# EAGLE design picstick_27j53_v1 (EAGLE 7.2.0)
pickstick - open source hardware
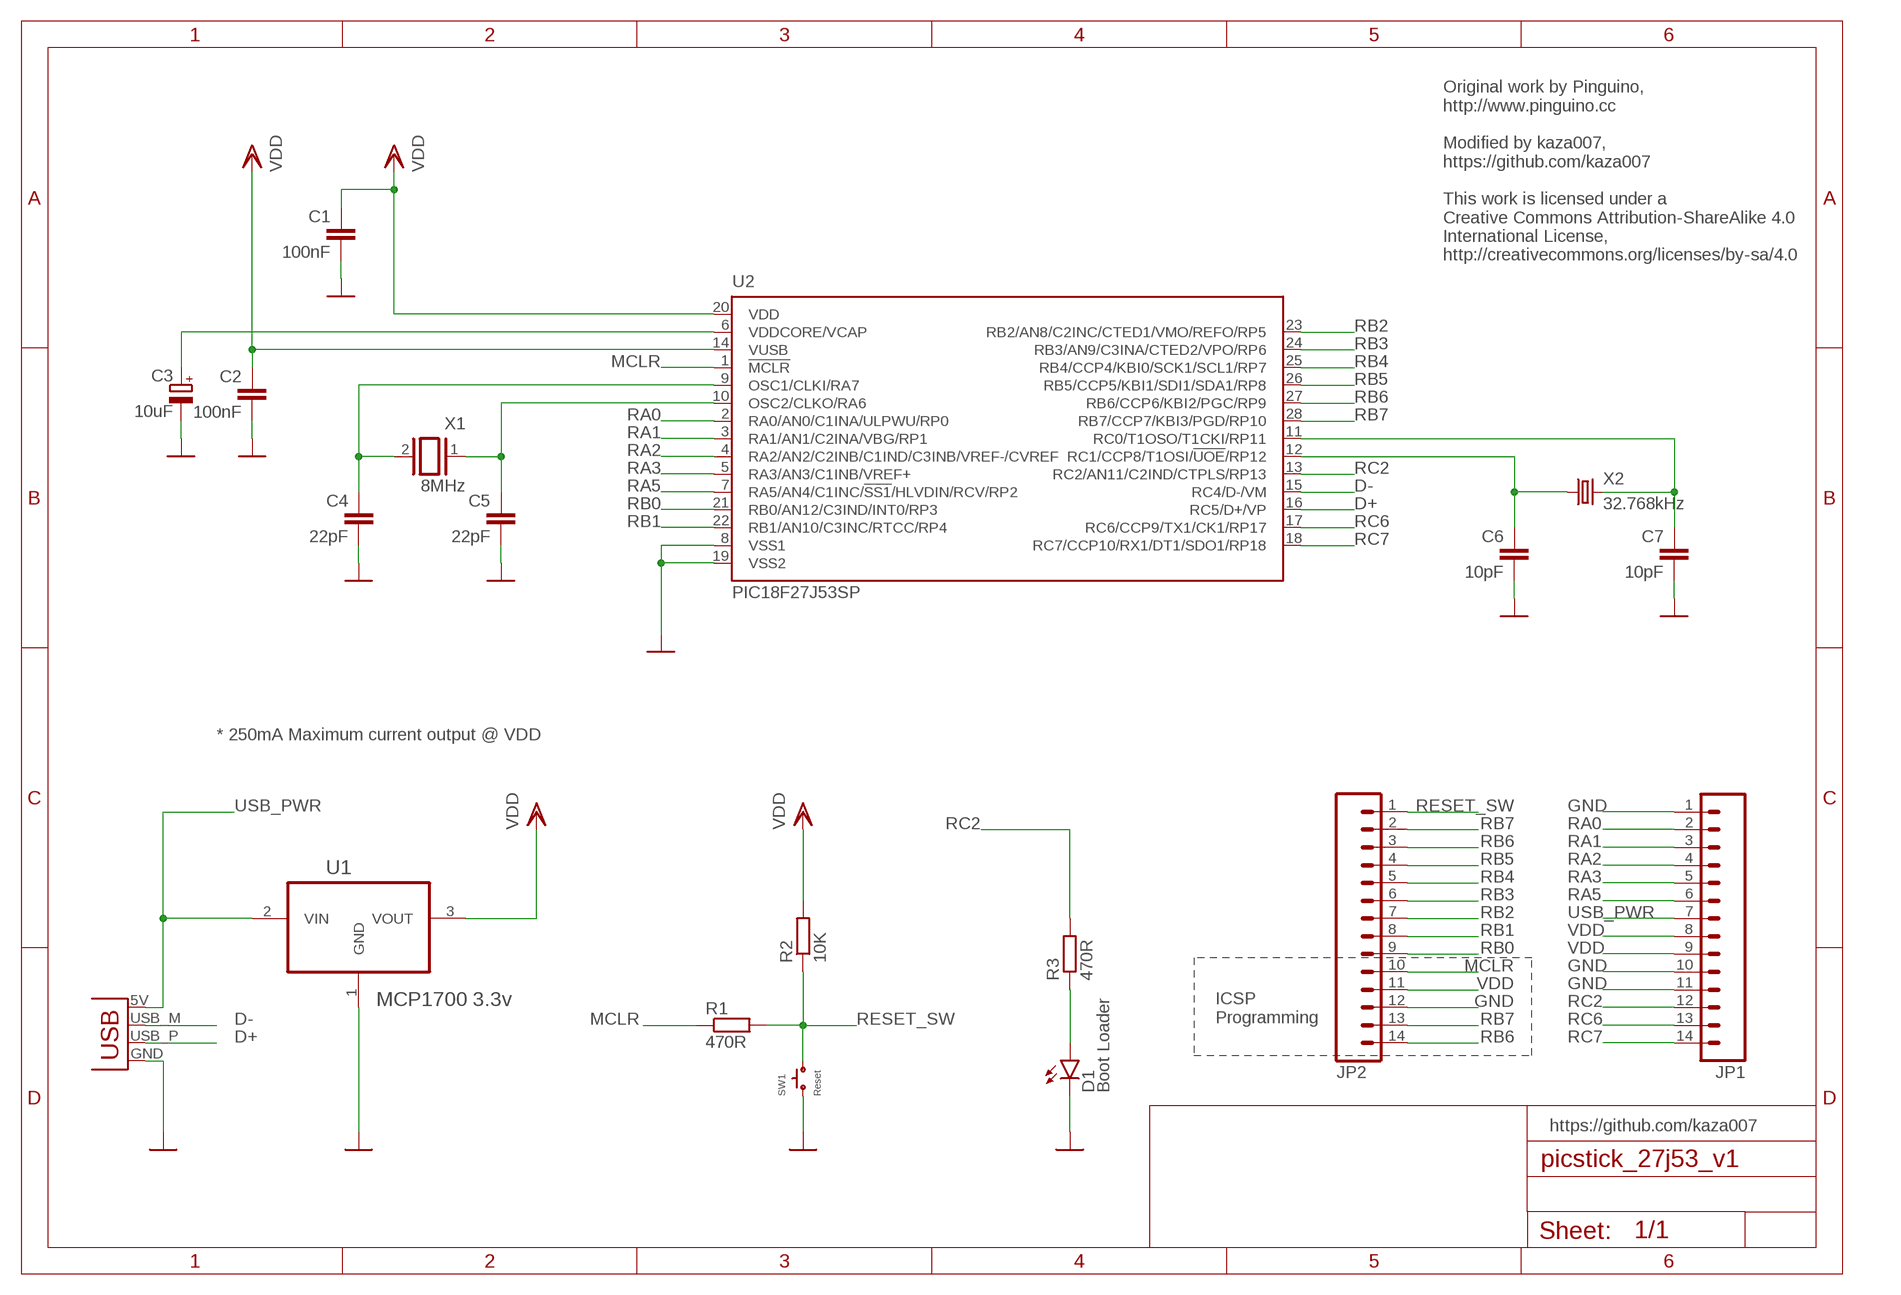
[diagram p0: schematic, sheet 1]

## Parts
C1  100nF  C-EU050-024X044  [C050-024X044]
C2  100nF  C-EU050-024X044  [C050-024X044]
C3  10uF  CPOL-EUE2.5-5  [E2,5-5]
C4  22pF  C-EU025-024X044  [C025-024X044]
C5  22pF  C-EU025-024X044  [C025-024X044]
C6  10pF  C-EU025-024X044  [C025-024X044]
C7  10pF  C-EU025-024X044  [C025-024X044]
D1  Boot Loader  LED3MM  [LED3MM]
JP1  FREETRONICS-JON_M14  [FREETRONICS-JON_1X14]
JP2  FREETRONICS-JON_M14  [FREETRONICS-JON_1X14]
R1  470R  R-EU_0204/7  [0204/7]
R2  10K  R-EU_0204/7  [0204/7]
R3  470R  R-EU_0204/7  [0204/7]
SW1  Reset  SKHLAAA010  [SKHLAAA010]
U1  MCP1700 3.3v  MCP1700-3302E/TO  [TO127P254X495-3]
U2  PIC18F27J53SP  [DIL28-3]
USB  FREETRONICS-MASTER-V1_USBPCB  [FREETRONICS-MASTER-V1_USB-A-PCB]
X1  8MHz  XTAL/S  [QS]
X2  32.768kHz  CRYSTALTC26H  [TC26H]

## Nets
D+: U2.16(RC5/D+/VP) USB.USB_P(D+)
D-: U2.15(RC4/D-/VM) USB.USB_M(D-)
GND: C1.2 C2.2 C3.- C4.2 C5.2 C6.2 C7.2 D1.K(C) JP1.1 JP1.10 JP1.11 JP2.12 SW1.1 U1.1(GND) U2.8(VSS1) U2.19(VSS2) USB.GND
MCLR: JP2.10 R1.1 U2.1(!MCLR)
N$1: C4.1 U2.9(OSC1/CLKI/RA7) X1.2
N$2: C5.1 U2.10(OSC2/CLKO/RA6) X1.1
N$3: C3.+ U2.6(VDDCORE/VCAP)
N$4: C7.1 U2.11(RC0/T1OSO/T1CKI/RP11) X2.2
N$5: C6.1 U2.12(RC1/CCP8/T1OSI/!UOE!/RP12) X2.1
N$6: D1.A R3.1
RA0: JP1.2 U2.2(RA0/AN0/C1INA/ULPWU/RP0)
RA1: JP1.3 U2.3(RA1/AN1/C2INA/VBG/RP1)
RA2: JP1.4 U2.4(RA2/AN2/C2INB/C1IND/C3INB/VREF-/CVREF)
RA3: JP1.5 U2.5(RA3/AN3/C1INB/VREF+)
RA5: JP1.6 U2.7(RA5/AN4/C1INC/!SS1!/HLVDIN/RCV/RP2)
RB0: JP2.9 U2.21(RB0/AN12/C3IND/INT0/RP3)
RB1: JP2.8 U2.22(RB1/AN10/C3INC/RTCC/RP4)
RB2: JP2.7 U2.23(RB2/AN8/C2INC/CTED1/VMO/REFO/RP5)
RB3: JP2.6 U2.24(RB3/AN9/C3INA/CTED2/VPO/RP6)
RB4: JP2.5 U2.25(RB4/CCP4/KBI0/SCK1/SCL1/RP7)
RB5: JP2.4 U2.26(RB5/CCP5/KBI1/SDI1/SDA1/RP8)
RB6: JP2.3 JP2.14 U2.27(RB6/CCP6/KBI2/PGC/RP9)
RB7: JP2.2 JP2.13 U2.28(RB7/CCP7/KBI3/PGD/RP10)
RC2: JP1.12 R3.2 U2.13(RC2/AN11/C2IND/CTPLS/RP13)
RC6: JP1.13 U2.17(RC6/CCP9/TX1/CK1/RP17)
RC7: JP1.14 U2.18(RC7/CCP10/RX1/DT1/SDO1/RP18)
RESET_SW: JP2.1 R1.2 R2.1 SW1.2
USB_PWR: JP1.7 U1.2(VIN) USB.5V(VBUS)
VDD: C1.1 C2.1 JP1.8 JP1.9 JP2.11 R2.2 U1.3(VOUT) U2.14(VUSB) U2.20(VDD)

## Notes on the sheet
- Original work by Pinguino,
  http://www.pinguino.cc
  
  Modified by kaza007,
  https://github.com/kaza007
  
  This work is licensed under a 
  Creative Commons Attribution-ShareAlike 4.0
  International License,
  http://creativecommons.org/licenses/by-sa/4.0
- * 250mA Maximum current output @ VDD
- ICSP
  Programming
- https://github.com/kaza007

## Library data of the parts
C1 C2 C4-C7 = rcl:C-EU: CAPACITOR, European symbol
C3 = rcl:CPOL-EU: POLARIZED CAPACITOR, European symbol
D1 = gm-diodes:LED
JP1 JP2 = LeoStick:FREETRONICS-JON_M14: Header 14 Standard 14-pin 0.1" header. Use with straight break away headers (SKU : PRT-00116), right angle break away headers (PRT-00553), swiss pins (PRT-00743), machine pins (PRT-00117), and female headers (PRT-00115).
R1-R3 = rcl:R-EU_: RESISTOR, European symbol
SW1 = alps:SKHLAAA010
U1 = mcp1700:MCP1700-3302E/TO: IC, Low Quiescent Current LDO,3.3V,TO-92; MPN: MCP1700-3302E/TO; OC_FARNELL: 1296588; OC_NEWARK: 88H9804; PACKAGE: TO-92; SUPPLIER: Microchip
U2 = microchip:PIC18F2*J53: PIC18F47J53 Family High-Performance USB Microcontrollers with nanoWatt XLP Technology Source: Data sheet <http://ww1.microchip.com/downloads/en/DeviceDoc/39964B.pdf>; MPN: PIC18F27J53-I/SP; OC_FARNELL: unknown; OC_NEWARK: 63R7839
USB = LeoStick:FREETRONICS-MASTER-V1_USB: USB Connectors USB-B-PTH is fully proven SKU : PRT-00139 USB-miniB is fully proven SKU : PRT-00587 USB-A-PCB is untested. USB-A-H is throughly reviewed, but untested. Spark Fun Electronics SKU : PRT-00437 USB-B-SMT is throughly reviewed, but untested. Needs silkscreen touching up. USB-A-S has not been used/tested USB-MB-H has not been used/tested
X1 = special:XTAL/S: CRYSTAL
X2 = crystal:CRYSTAL: CRYSTAL; OC_FARNELL: unknown; OC_NEWARK: unknown

## Board
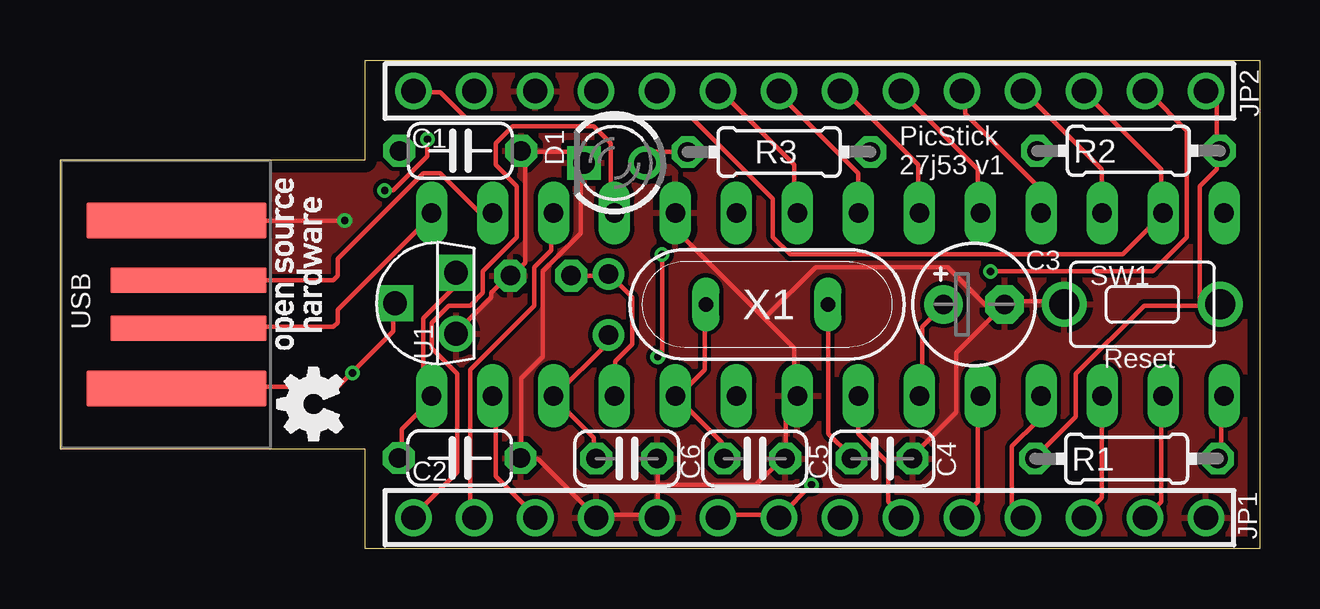
[diagram p1: board, top side]
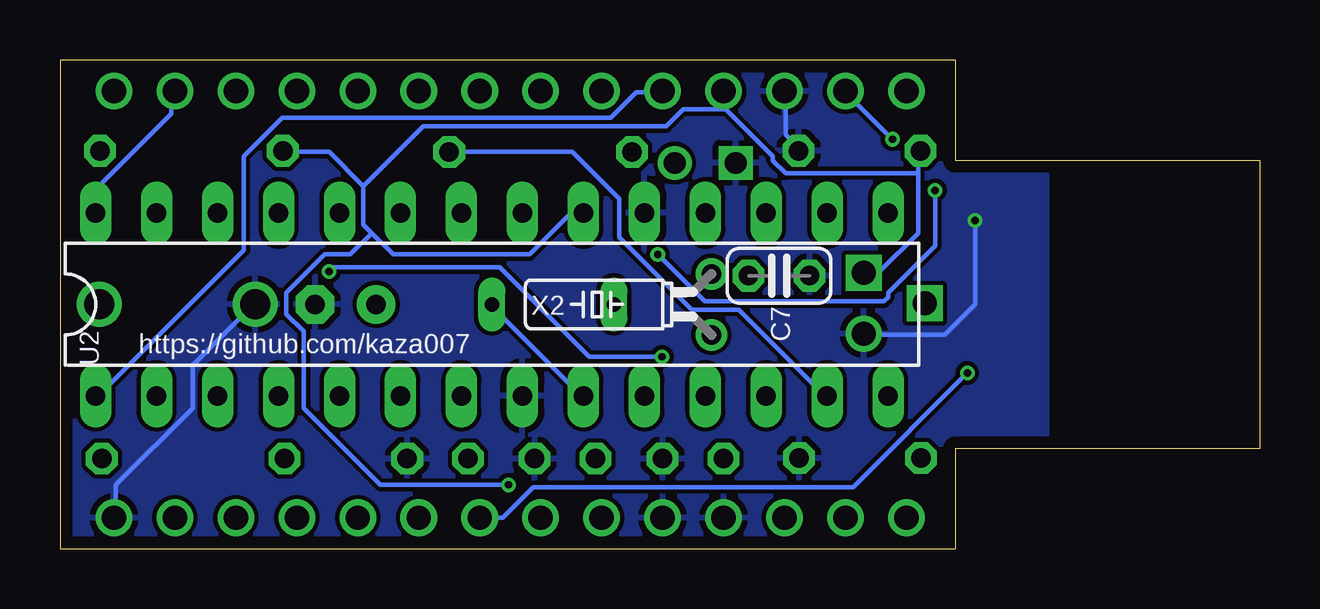
[diagram p2: board, bottom side, seen from below]

Size 49.99 x 20.37 mm. Coordinates in mm from the lower left corner, seen from the top.
Outline: 0,4.18 12.69,4.18 12.69,0 49.99,0 49.99,20.37 12.69,20.37 12.69,16.19 0,16.19 0,4.18
Outline: 0,4.18 0,4.18
Copper layers (1*16): Top 0.035mm / dielectric 1.9mm / Bottom 0.035mm
Design rules "ShenZhen2U EagleRules *": minimum track width 7mil, minimum drill 12mil, track to track 7mil, track to pad 7mil, pad to pad 7mil, via to via 7mil, smd to smd 0mil, copper to edge 20mil, drill to drill 10mil, minimum pad ring 10mil, minimum via ring 6mil, stop-mask expansion 2mil, vias tented up to drill 25mil, thermal gap 10mil

### Footprints (pad centres in the part's own frame; a part is rotated, then mirrored left to right if it is on the bottom)
C050-024X044 = drill 0.813 octagon: 1 -2.54,0; 2 2.54,0
E2,5-5 = drill 0.813 pad 1.6: + -1.27,0 | drill 0.813 pad 1.6 octagon: - 1.27,0
C025-024X044 = drill 0.813 octagon: 1 -1.27,0; 2 1.27,0
LED3MM = drill 0.9: A -1.27,0 | drill 0.9 square: K 1.27,0
FREETRONICS-JON_1X14 = drill 1.016: 1 0,0; 2 2.54,0; 3 5.08,0; 4 7.62,0; 5 10.16,0; 6 12.7,0; 7 15.24,0; 8 17.78,0; 9 20.32,0; 10 22.86,0; 11 25.4,0; 12 27.94,0; 13 30.48,0; 14 33.02,0
0204/7 = drill 0.813 octagon: 1 -3.81,0; 2 3.81,0
SKHLAAA010 = drill 1.25: 1 -3.25,0; 2 3.25,0
TO127P254X495-3 = drill 0.991: 1 -1.27,-1.27 | drill 0.991 square: 2 0,1.27; 3 1.27,-1.27
DIL28-3 = drill 0.813 long: 1 -16.51,-3.81; 2 -13.97,-3.81; 3 -11.43,-3.81; 4 -8.89,-3.81; 5 -6.35,-3.81; 6 -3.81,-3.81; 7 -1.27,-3.81; 8 1.27,-3.81; 9 3.81,-3.81; 10 6.35,-3.81; 11 8.89,-3.81; 12 11.43,-3.81; 13 13.97,-3.81; 14 16.51,-3.81; 15 16.51,3.81; 16 13.97,3.81; 17 11.43,3.81; 18 8.89,3.81; 19 6.35,3.81; 20 3.81,3.81; 21 1.27,3.81; 22 -1.27,3.81; 23 -3.81,3.81; 24 -6.35,3.81; 25 -8.89,3.81; 26 -11.43,3.81; 27 -13.97,3.81; 28 -16.51,3.81
FREETRONICS-MASTER-V1_USB-A-PCB = smd 7.5 x 1.5: 5V -0.2,-3.5; GND -0.2,3.5 | smd 6.5 x 1.067: USB_M 0.3,-1; USB_P 0.3,1
QS = drill 0.61 long: 1 -2.54,0; 2 2.54,0
TC26H = drill 0.813: 1 -1.27,0; 2 1.27,0

### Placement (x,y rotation side)
C1  16.68,16.59 0 top
C2  16.65,3.78 0 top
C3  38.09,10.19 0 top
C4  34.25,3.76 0 top
C5  28.95,3.76 0 top
C6  23.61,3.76 0 top
C7  20.03,11.38 0 bottom
D1  23.1,16.08 180 top
JP1  47.74,1.3 180 top
JP2  47.74,19.08 180 top
R1  44.44,3.76 180 top
R2  44.52,16.59 180 top
R3  29.96,16.54 0 top
SW1  45.1,10.19 0 top
U1  15.23,10.24 90 top
U2  31.99,10.19 0 bottom
USB  5.05,10.19 0 top
X1  29.45,10.19 0 top
X2  22.85,10.19 90 bottom

### Tracks (layer width: path | path; a pad name or v marks a point on that pad's centre or on a via)
D+
  Top 0.178: U2.16 17.97,14.05 17.44,14.05 15.84,15.65 15.13,15.65 11.57,12.09 11.57,11.38 11.39,11.2 5.53,11.2 USB.USB_P
D-
  Top 0.178: U2.15 15.48,13.87 11.57,9.96 11.57,9.42 11.39,9.25 5.53,9.25 USB.USB_M
GND  (via drill 0.3)
  Top 0.178: C3.- 38.95,9.78 | 38.95,9.78 37.35,8.18 37.35,5.69 35.58,3.91 C4.2 | SW1.1 41.8,10.31 39.49,10.31 C3.- | 19.4,16.54 21.35,16.54 21.71,16.18 D1.K 21.71,16 21.71,13.16 20.11,11.56 20.11,8 19.22,7.11 19.22,3.91 C2.2 19.22,3.73 19.93,3.73 22.24,1.42 JP1.11 22.42,1.42 24.73,1.42 JP1.10 24.91,1.42 24.91,2.67 | 19.4,16.54 19.22,16.54 C1.2 19.4,16.54 | U1.1 16.55,9.07 17.97,10.49 17.97,10.67 18.68,11.38 C7.2 18.86,11.38 19.4,11.91 19.4,16.54 | 24.91,2.67 24.91,3.73 C6.2 | 29.35,9.6 30.6,8.36 30.6,6.4 U2.8 30.6,6.22 30.24,5.87 30.24,3.91 C5.2 30.06,3.73 29,2.67 24.91,2.67 | 29.35,9.6 25.8,13.16 25.8,13.87 U2.19 | 38.95,9.78 37,11.73 31.49,11.73 29.35,9.6 | 39.31,10.13 C3.- | v11.86,13.68 4.88,13.68 USB.GND
  Bottom 0.178: JP2.12 19.75,19.02 19.75,17.25 19.22,16.71 C1.2 | JP1.1 47.67,1.42 47.67,2.67 44.46,5.87 44.46,7.65 41.98,10.13 SW1.1 | v11.86,13.68 11.86,10.19 13.13,8.92 16.31,8.92 U1.1
  pour Bottom: 8.88,16.03 12.94,16.03 12.94,20.09 49.77,20.09 49.77,0.28 12.94,0.28 12.94,4.34 8.88,4.34
  pour Top: 8.88,16.03 12.94,16.03 12.94,20.09 49.77,20.09 49.77,0.28 12.94,0.28 12.94,4.34 8.88,4.34
MCLR
  Top 0.178: R1.1 48.38,3.91 48.38,6.22 U2.1
  Bottom 0.178: JP2.10 24.91,19.02 25.97,19.02 27.04,17.96 40.73,17.96 42.33,16.36 42.33,12.45 48.38,6.4 U2.1
N$1
  Top 0.178: X1.2 32.02,10.13 32.02,4.8 32.91,3.91 C4.1
  Bottom 0.178: U2.9 28.29,6.4 32.02,10.13 X1.2
N$2
  Top 0.178: X1.1 26.86,10.13 26.86,7.47 25.8,6.4 U2.10 27.57,4.45 27.57,3.91 C5.1
N$3
  Top 0.178: U2.6 35.93,6.4 35.93,9.25 36.82,10.13 C3.+
N$4
  Top 0.178: C7.1 22.77,11.38 X2.2 22.95,11.38 23.84,10.49 23.84,8.53 23.13,7.82 23.13,6.4 U2.11
N$5
  Top 0.178: C6.1 22.24,3.91 22.24,4.62 20.64,6.22 U2.12 20.64,6.4 22.77,8.53 22.77,8.89 X2.1
N$6
  Top 0.178: R3.1 24.73,16.54 24.37,16.18 D1.A
RA0
  Top 0.178: U2.2 45.89,6.22 45.89,1.96 45.35,1.42 JP1.2
RA1
  Top 0.178: U2.3 43.4,6.22 43.4,2.13 42.69,1.42 JP1.3
RA2
  Top 0.178: U2.4 40.73,6.22 40.73,5.33 39.66,4.27 39.66,1.78 40.02,1.42 JP1.4
RA3
  Top 0.178: JP1.5 38.24,1.96 38.24,6.22 U2.5
RA5
  Top 0.178: U2.7 33.26,4.8 34.51,3.56 34.51,1.96 35.04,1.42 JP1.6
RB0
  Top 0.178: U2.21 30.6,14.05 30.6,16 27.57,19.02 JP2.9
RB1
  Top 0.178: U2.22 33.26,15.65 29.89,19.02 JP2.8
RB2
  Top 0.178: U2.23 35.75,14.05 35.75,16 32.55,19.2 JP2.7
RB3
  Top 0.178: U2.24 38.24,14.05 38.24,15.82 35.04,19.02 JP2.6
RB4
  Top 0.178: U2.25 40.73,14.05 40.73,15.11 37.71,18.14 37.71,19.02 JP2.5
RB5
  Top 0.178: U2.26 43.4,14.05 43.4,15.82 40.2,19.02 JP2.4
RB6
  Top 0.178: JP2.3 42.69,19.02 45.89,15.82 45.89,14.05 U2.27 45.89,13.87 44.29,12.27 30.42,12.27 29.71,12.98 29.71,14.58 26.33,17.96 16.91,17.96 15.84,19.02 14.77,19.02 JP2.14
RB7  (via drill 0.3)
  Top 0.178: v15.31,17.07 15.31,16.36 13.88,14.94 v13.53,14.94 | v25.09,12.27 25.09,8.18 v24.91,8 | v38.78,11.56 45.53,11.56 46.95,12.98 46.95,17.42 45.35,19.02 JP2.2
  Bottom 0.178: U2.28 48.38,14.05 48.38,15.11 45.35,18.14 45.35,19.02 JP2.2 | v15.31,17.07 17.26,19.02 JP2.13 | v13.53,14.94 13.53,12.62 15.48,10.67 15.48,10.49 15.66,10.31 23.13,10.31 v25.09,12.27 | v24.91,8 27.93,8 31.66,11.73 38.6,11.73 v38.78,11.56
RC2
  Top 0.178: U2.13 18.15,6.22 18.15,3.02 19.75,1.42 JP1.12
  Bottom 0.178: R3.2 28.64,16.54 26.68,14.58 26.68,12.98 23.66,9.96 21.71,9.96 18.15,6.4 U2.13
RC6
  Top 0.178: U2.17 20.46,13.87 20.46,12.45 19.75,11.73 19.75,10.13 17.08,7.47 17.08,1.6 17.26,1.42 JP1.13
RC7
  Top 0.178: U2.18 22.95,14.05 22.95,16.89 22.24,17.6 18.86,17.6 18.15,16.89 18.15,16 19.04,15.11 19.04,12.98 17.62,11.56 17.62,10.67 17.08,10.13 16.2,10.13 15.48,9.42 15.48,8.36 16.55,7.29 16.55,3.2 14.77,1.42 JP1.14
RESET_SW
  Top 0.178: JP2.1 47.84,19.02 48.2,18.67 48.2,16.71 R2.1 48.2,16.54 48.2,15.82 47.49,15.11 47.49,10.13 | 47.49,10.13 48.2,10.13 SW1.2 47.49,10.13 | 47.49,10.13 45.18,10.13 42.33,7.29 42.33,5.51 40.73,3.91 R1.2
USB_PWR  (via drill 0.3)
  Top 0.178: 12.16,7.35 11.57,6.76 4.99,6.76 USB.5V | 12.16,7.35 13.88,9.07 13.88,10.13 U1.2 | v12.18,7.33 12.16,7.35
  Bottom 0.178: JP1.7 31.55,1.3 30.28,2.57 16.94,2.57 v12.18,7.33
VDD  (via drill 0.3)
  Top 0.178: C2.1 14.24,3.91 14.24,4.98 15.48,6.22 U2.14 15.48,6.4 15.13,6.76 15.13,9.6 16.37,10.85 16.37,11.38 U1.3 | JP1.9 27.57,1.42 29.89,1.42 JP1.8 30.06,1.42 v31.31,2.67
  Bottom 0.178: 14.24,15.65 14.24,13.16 15.84,11.56 16.37,11.56 U1.3 | 14.24,15.65 14.24,16.54 C1.1 | 22.24,18.31 22.24,19.02 JP2.11 | 22.24,18.31 20.29,16.36 20.29,16.18 19.75,15.65 14.24,15.65 | 37,13.16 37.35,13.51 37.35,15.11 | 37,13.16 36.11,12.27 30.42,12.27 28.82,13.87 28.29,13.87 U2.20 | 37.35,15.11 38.78,16.54 40.55,16.54 R2.2 | v31.31,2.67 36.64,2.67 39.84,5.87 39.84,9.07 40.55,9.78 40.55,10.67 38.95,12.27 37.89,12.27 37,13.16 | 22.24,18.31 24.02,18.31 24.73,17.6 34.86,17.6 37.35,15.11

### Text on the board
tPlace: PicStick / 27j53 v1 | SW1 | Reset
bNames: https://github.com/kaza007